# EAGLE design fb3.32_2x4_01 (EAGLE 5.00)
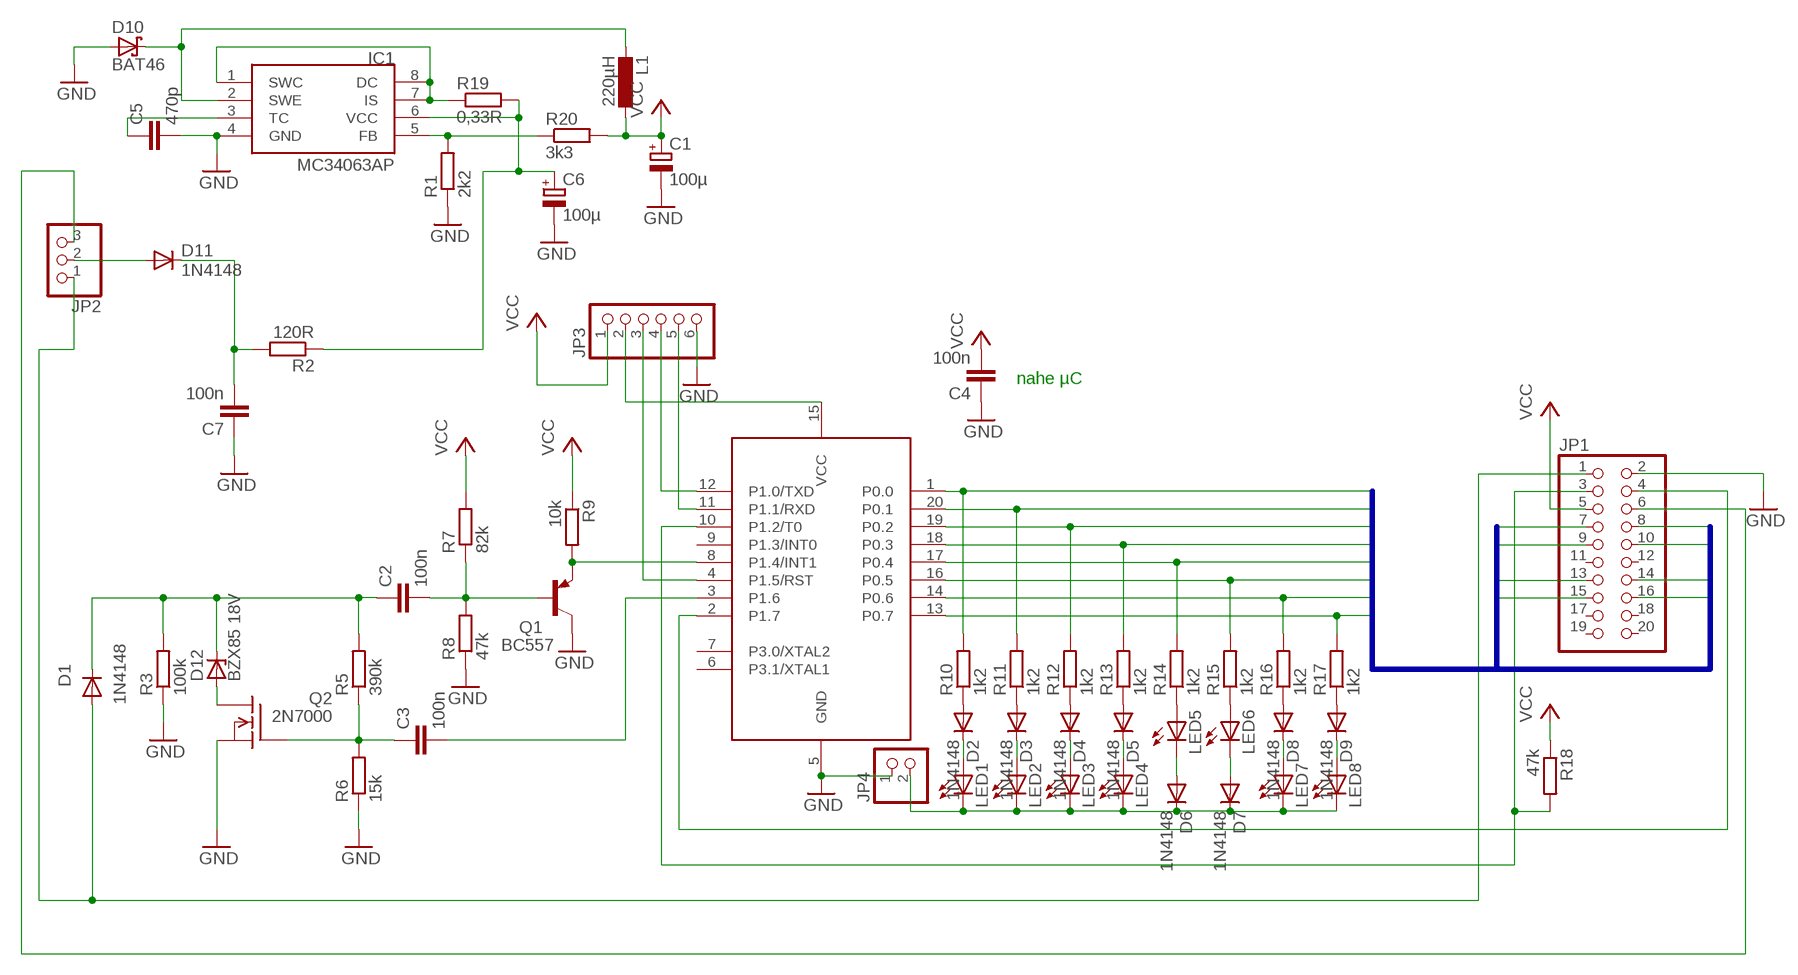
[diagram p0: schematic, sheet 1]

## Parts
C1  100µ  CPOL-EUE5-8.5  [E5-8,5]
C2  100n  C-EU050-024X044  [C050-024X044]
C3  100n  C-EU050-024X044  [C050-024X044]
C4  100n  C-EU050-024X044  [C050-024X044]
C5  470p  C-EU025-024X044  [C025-024X044]
C6  100µ  CPOL-EUE5-8.5  [E5-8,5]
C7  100n  C-EU050-024X044  [C050-024X044]
D1  1N4148  [DO35-10]
D2  1N4148  [DO35-10]
D3  1N4148  [DO35-10]
D4  1N4148  [DO35-10]
D5  1N4148  [DO35-10]
D6  1N4148  [DO35-10]
D7  1N4148  [DO35-10]
D8  1N4148  [DO35-10]
D9  1N4148  [DO35-10]
D10  BAT46  BAT49  [DO41-10]
D11  1N4148  [DO35-10]
D12  BZX85 18V  BZX85  [DO41Z10]
IC1  MC34063AP  [DIL08]
JP1  PINHD-2X10  [2X10]
JP2  PINHD-1X3  [1X03]
JP3  PINHD-1X6  [1X06]
JP4  PINHD-1X2  [1X02]
L1  220µH  L-EU2200-12.7  [2200-12.7]
LED1  LED3MM  [LED3MM]
LED2  LED3MM  [LED3MM]
LED3  LED3MM  [LED3MM]
LED4  LED3MM  [LED3MM]
LED5  LED3MM  [LED3MM]
LED6  LED3MM  [LED3MM]
LED7  LED3MM  [LED3MM]
LED8  LED3MM  [LED3MM]
Q1  BC557  [TO92]
Q2  2N7000  VN2222KM  [TO237]
R1  2k2  R-EU_0207/10  [0207/10]
R2  120R  R-EU_0207/10  [0207/10]
R3  100k  R-EU_0207/10  [0207/10]
R5  390k  R-EU_0207/10  [0207/10]
R6  15k  R-EU_0207/10  [0207/10]
R7  82k  R-EU_0207/10  [0207/10]
R8  47k  R-EU_0207/10  [0207/10]
R9  10k  R-EU_0207/2V  [0207/2V]
R10  1k2  R-EU_0207/10  [0207/10]
R11  1k2  R-EU_0207/10  [0207/10]
R12  1k2  R-EU_0207/10  [0207/10]
R13  1k2  R-EU_0207/10  [0207/10]
R14  1k2  R-EU_0207/10  [0207/10]
R15  1k2  R-EU_0207/5V  [0207/5V]
R16  1k2  R-EU_0207/10  [0207/10]
R17  1k2  R-EU_0207/10  [0207/10]
R18  47k  R-EU_0207/10  [0207/10]
R19  0,33R  R-EU_0207/10  [0207/10]
R20  3k3  R-EU_0207/10  [0207/10]
U1  89LPC922  [DIL20]

## Nets
BASIC_RECIVE: C2.2 Q1.2(B) R7.1 R8.2
EIB+: D1.A JP1.1 JP2.1
FET_GATE: C3.1 Q2.2(G) R5.1 R6.2
FREQ: C5.1 IC1.3(TC)
GND: C1.- C4.1 C5.2 C6.- C7.1 D10.A IC1.4(GND) JP1.2 JP3.6 JP4.1 Q1.3(C) Q2.3(S) R1.1 R3.1 R6.1 R8.1 U1.5(GND)
I_SENSED: IC1.1(SWC) IC1.7(IS) IC1.8(DC) R19.1
INDUCTOR: D10.C IC1.2(SWE) L1.2
LEDSELECT: D6.C D7.C JP4.2 LED1.K(C) LED2.K(C) LED3.K(C) LED4.K(C) LED7.K(C) LED8.K(C)
LPC_RECIVE: Q1.1(E) R9.2 U1.8(P1.4/INT1)
LPC_SEND: C3.2 U1.3(P1.6)
N$1: JP1.6 JP2.3
N$2: C7.2 D11.C R2.2
N$3: D2.A R10.1
N$4: D3.A R11.1
N$6: D12.A Q2.1(D)
N$7: IC1.5(FB) R1.2 R20.1
N$8: D4.A R12.1
N$10: D5.A R13.1
N$13: D8.A R16.1
N$14: D9.A R17.1
N$15: D2.C LED1.A
N$17: C2.1 D1.C D12.C R3.2 R5.2
N$20: D3.C LED2.A
N$21: D4.C LED3.A
N$22: D5.C LED4.A
N$23: D6.A LED5.K(C)
N$24: D7.A LED6.K(C)
N$25: D8.C LED7.A
N$26: D9.C LED8.A
N$27: LED5.A R14.1
N$29: JP3.4 U1.12(P1.0/TXD)
N$30: JP3.5 U1.11(P1.1/RXD)
N$31: JP3.3 U1.4(P1.5/RST)
N$35: LED6.A R15.1
P0.0: JP1.7 R10.2 U1.1(P0.0)
P0.1: JP1.8 R11.2 U1.20(P0.1)
P0.2: JP1.9 R12.2 U1.19(P0.2)
P0.3: JP1.10 R13.2 U1.18(P0.3)
P0.4: JP1.13 R14.2 U1.17(P0.4)
P0.5: JP1.14 R15.2 U1.16(P0.5)
P0.6: JP1.15 R16.2 U1.14(P0.6)
P0.7: JP1.16 R17.2 U1.13(P0.7)
PROG: JP1.4 U1.2(P1.7)
PWM_LPC: JP1.3 R18.2 U1.10(P1.2/T0)
SELECTED: D11.A JP2.2
SUPPLY_FILTRED: C6.+ IC1.6(VCC) R2.1 R19.2
VCC: C1.+ C4.2 JP1.5 JP3.1 L1.1 R7.2 R9.1 R18.1 R20.2
VCC_LPC: JP3.2 U1.15(VCC)
Unconnected: JP1.11 JP1.12 JP1.17 JP1.18 JP1.19 JP1.20 U1.6(P3.1/XTAL1) U1.7(P3.0/XTAL2) U1.9(P1.3/INT0)

## Buses
P0.[0..7]

## Notes on the sheet
- nahe µC

## Library data of the parts
C1 C6 = rcl:CPOL-EU: POLARIZED CAPACITOR, European symbol
C2-C5 C7 = rcl:C-EU: CAPACITOR, European symbol
D1-D9 D11 = diode:1N4148: DIODE high speed (Philips)
D10 = diode:BAT49: DIODE small signal diode
D12 = diode:BZX85: Z DIODE
IC1 = mc34063:MC34063
JP1 = pinhead:PINHD-2X10: PIN HEADER
JP2 = pinhead:PINHD-1X3: PIN HEADER
JP3 = pinhead:PINHD-1X6: PIN HEADER
JP4 = pinhead:PINHD-1X2: PIN HEADER
L1 = rcl:L-EU: INDUCTOR, European symbol
LED1-LED8 = led:LED: LED OSRAM: - CHIPLED LG R971, LG N971, LY N971, LG Q971, LY Q971, LO R971, LY R971 LH N974, LH R974 LS Q976, LO Q976, LY Q976 LO Q996 - Hyper CHIPLED LW Q18S LB Q993, LB Q99A, LB R99A - SideLED LS A670, LO A670, LY A670, LG A670, LP A670 LB A673, LV A673, LT A673, LW A673 LH A674 LY A675 LS A676, LA A676, LO A676, LY A676, LW A676 LS A679, LY A679, LG A679 - Hyper Micro SIDELED® LS Y876, LA Y876, LO Y876, LY Y876 LT Y87S - SmartLED LW L88C, LW L88S LB L89C, LB L89S, LG L890 LS L89K, LO L89K, LY L89K LS L896, LA L896, LO L896, LY L896 - TOPLED LS T670, LO T670, LY T670, LG T670, LP T670 LSG T670, LSP T670, LSY T670, LOP T670, LYG T670 LG T671, LOG T671, LSG T671 LB T673, LV T673, LT T673, LW T673 LH T674 LS T676, LA T676, LO T676, LY T676, LB T676, LH T676, LSB T676, LW T676 LB T67C, LV T67C, LT T67C, LS T67K, LO T67K, LY T67K, LW E67C LS E67B, LA E67B, LO E67B, LY E67B, LB E67C, LV E67C, LT E67C LW T67C LS T679, LY T679, LG T679 LS T770, LO T770, LY T770, LG T770, LP T770 LB T773, LV T773, LT T773, LW T773 LH T774 LS E675, LA E675, LY E675, LS T675 LS T776, LA T776, LO T776, LY T776, LB T776 LHGB T686 LT T68C, LB T68C - Hyper Mini TOPLED® LB M676 - Mini TOPLED Santana® LG M470 LS M47K, LO M47K, LY M47K Source: http://www.osram.convergy.de - LUMILED® LXK2-PW12-R00, LXK2-PW12-S00, LXK2-PW14-U00, LXK2-PW14-V00 LXK2-PM12-R00, LXK2-PM12-S00, LXK2-PM14-U00 LXK2-PE12-Q00, LXK2-PE12-R00, LXK2-PE12-S00, LXK2-PE14-T00, LXK2-PE14-U00 LXK2-PB12-K00, LXK2-PB12-L00, LXK2-PB12-M00, LXK2-PB14-N00, LXK2-PB14-P00, LXK2-PB14-Q00 LXK2-PR12-L00, LXK2-PR12-M00, LXK2-PR14-Q00, LXK2-PR14-R00 LXK2-PD12-Q00, LXK2-PD12-R00, LXK2-PD12-S00 LXK2-PH12-R00, LXK2-PH12-S00 LXK2-PL12-P00, LXK2-PL12-Q00, LXK2-PL12-R00 Source: www.luxeon.com
Q1 = transistor-pnp:BC557: PNP Transistor
Q2 = transistor-fet:VN2222KM: N-Channel Enhancement MOSFET (VMOS); 60V; 0,5A; 7,5Ohm
R1-R3 R5-R20 = rcl:R-EU_: RESISTOR, European symbol
U1 = micro-philips:89LPC922

## Board
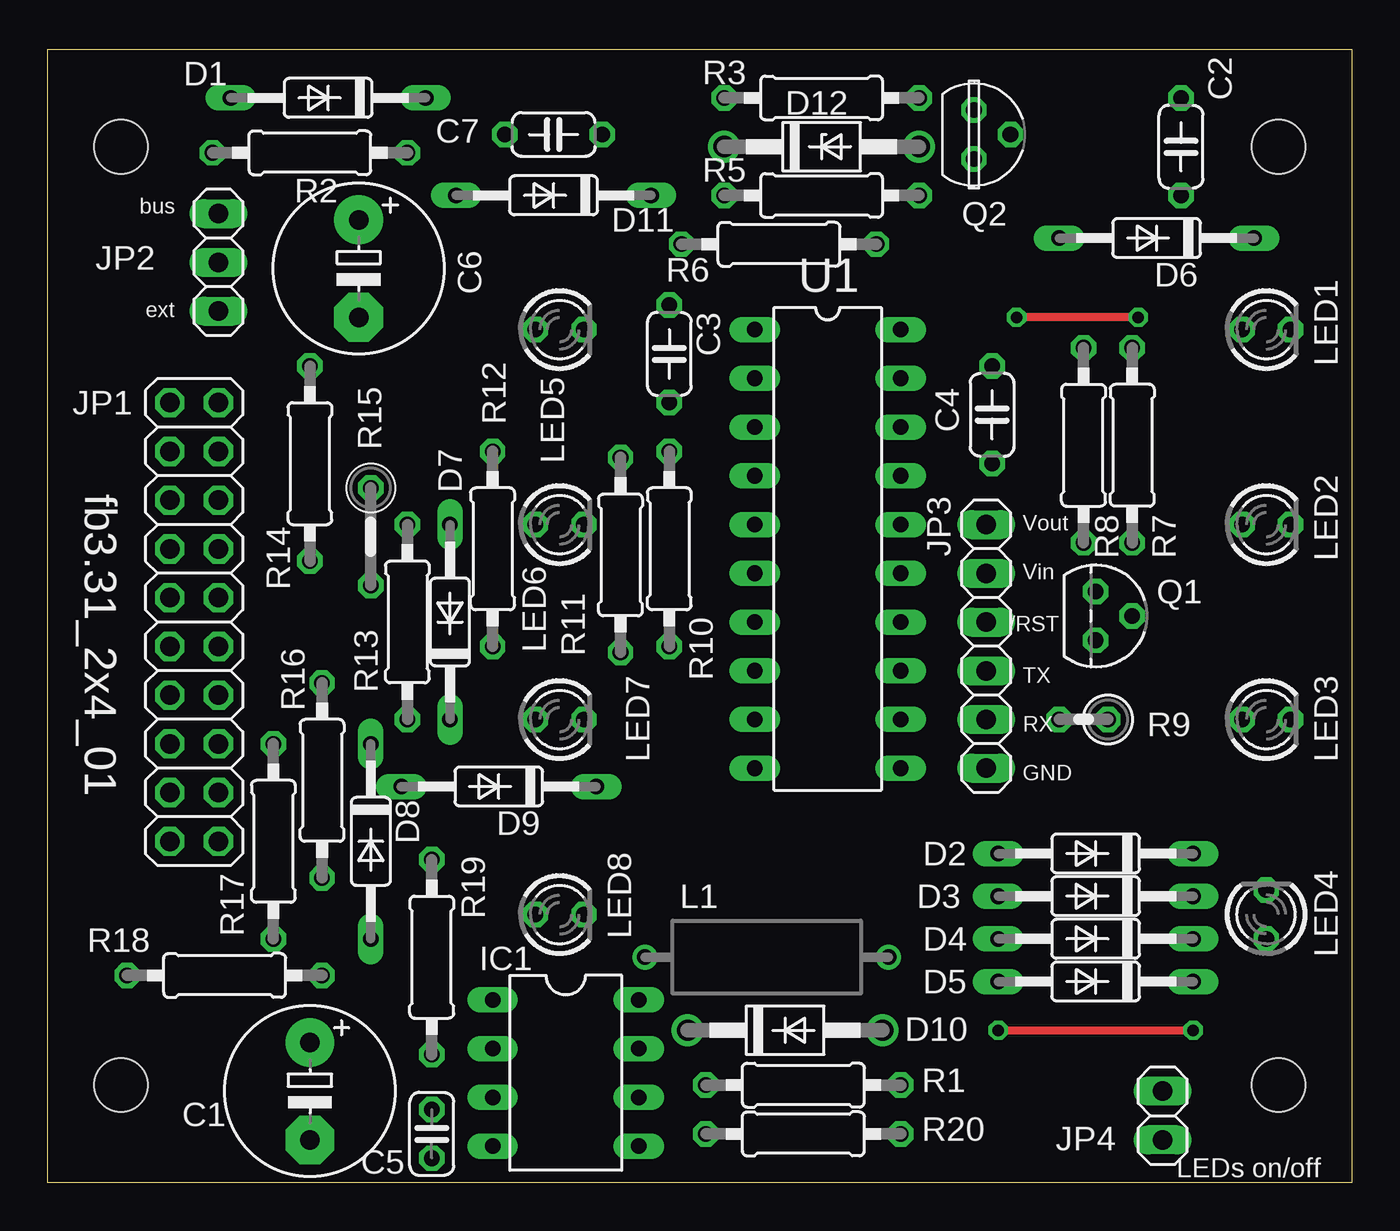
[diagram p1: board, top side]
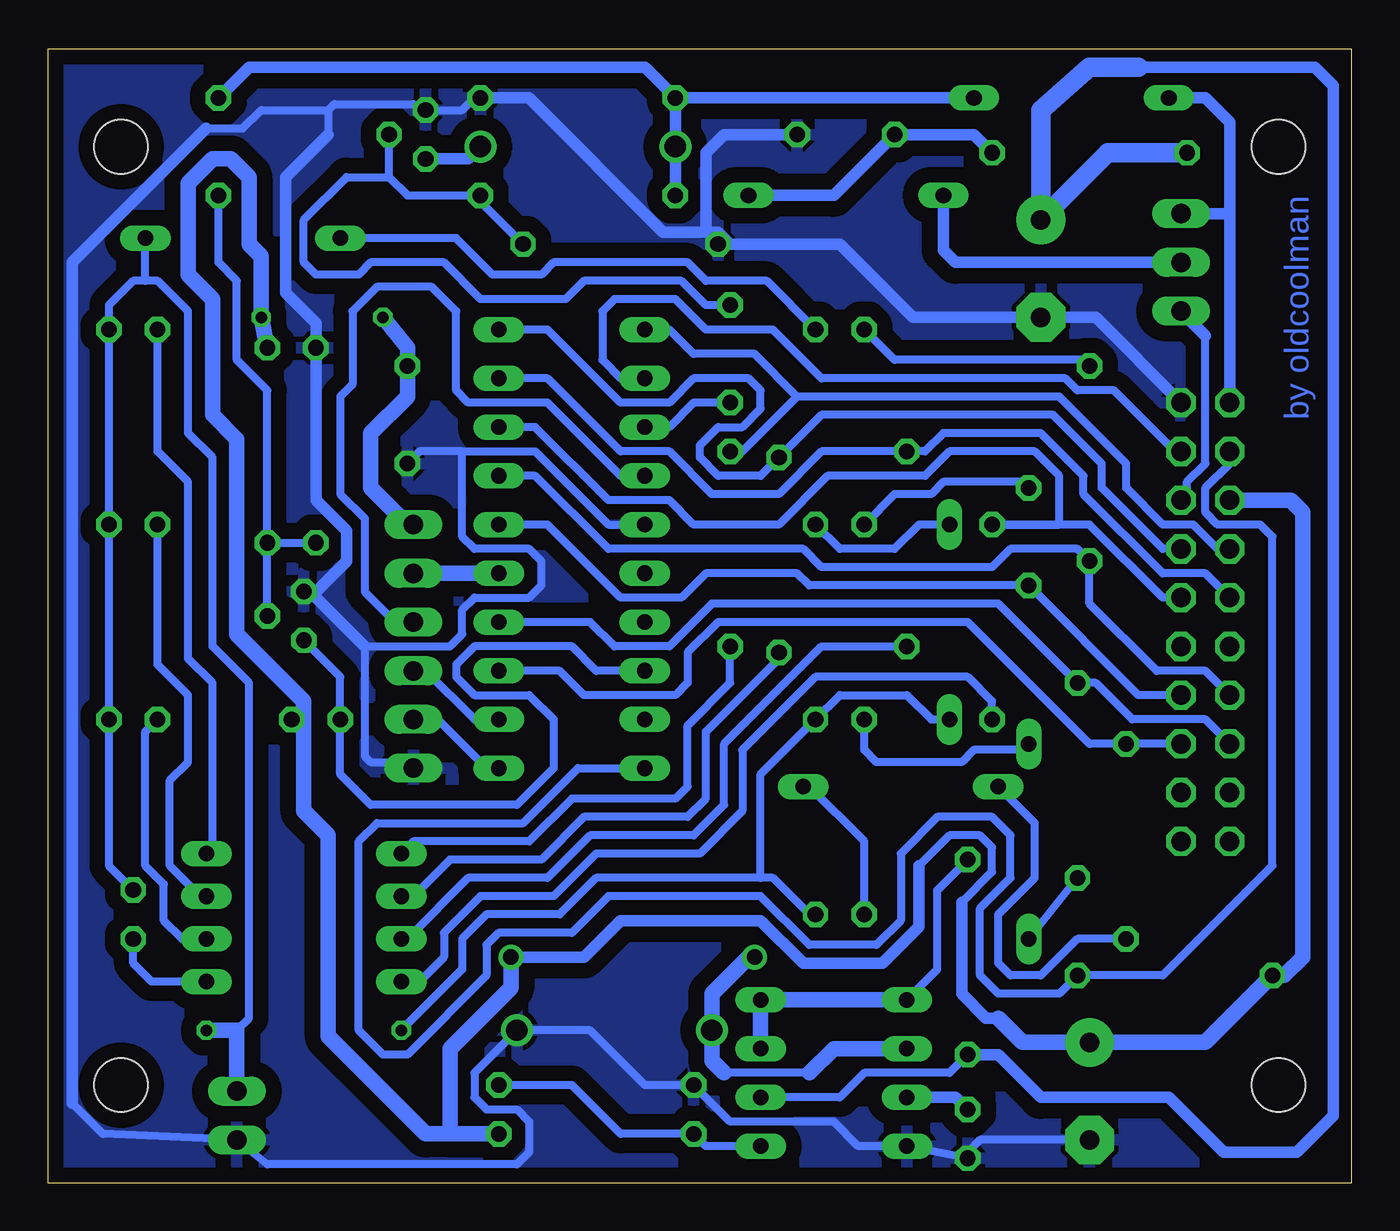
[diagram p2: board, bottom side, seen from below]

Size 67.94 x 59.05 mm. Coordinates in mm from the lower left corner, seen from the top.
Outline: 0,0 0,59.05 67.94,59.05 67.94,0 0,0
Copper layers (1*16): Top 0.035mm / dielectric 1.5mm / Bottom 0.035mm
Design rules "default": minimum track width 10mil, minimum drill 24mil, track to track 12mil, track to pad 12mil, pad to pad 12mil, via to via 12mil, smd to smd 8mil, copper to edge 20mil, drill to drill 8mil, minimum pad ring 10mil, minimum via ring 8mil, stop-mask expansion 4mil, vias tented up to drill 0mil, thermal gap 10mil
Holes 2.8 mm at 3.81,53.98 64.14,53.98 64.14,5.08 3.81,5.08

### Footprints (pad centres in the part's own frame; a part is rotated, then mirrored left to right if it is on the bottom)
E5-8,5 = drill 1.016 pad 2.54 round: + -2.54,0 | drill 1.016 pad 2.54 octagon: - 2.54,0
C050-024X044 = drill 0.813 octagon: 1 -2.54,0; 2 2.54,0
C025-024X044 = drill 0.813 octagon: 1 -1.27,0; 2 1.27,0
DO35-10 = drill 0.813 long: A 5.08,0; C -5.08,0
DO41-10 = drill 1.118 round: A 5.08,0; C -5.08,0
DO41Z10 = drill 1.118 round: A 5.08,0; C -5.08,0
DIL08 = drill 0.813 long: 1 -3.81,-3.81; 2 -1.27,-3.81; 3 1.27,-3.81; 4 3.81,-3.81; 5 3.81,3.81; 6 1.27,3.81; 7 -1.27,3.81; 8 -3.81,3.81
2X10 = drill 1.016 octagon: 1 -11.43,-1.27; 2 -11.43,1.27; 3 -8.89,-1.27; 4 -8.89,1.27; 5 -6.35,-1.27; 6 -6.35,1.27; 7 -3.81,-1.27; 8 -3.81,1.27; 9 -1.27,-1.27; 10 -1.27,1.27; 11 1.27,-1.27; 12 1.27,1.27; 13 3.81,-1.27; 14 3.81,1.27; 15 6.35,-1.27; 16 6.35,1.27; 17 8.89,-1.27; 18 8.89,1.27; 19 11.43,-1.27; 20 11.43,1.27
1X03 = drill 1.016 long: 1 -2.54,0; 2 0,0; 3 2.54,0
1X06 = drill 1.016 long: 1 -6.35,0; 2 -3.81,0; 3 -1.27,0; 4 1.27,0; 5 3.81,0; 6 6.35,0
1X02 = drill 1.016 long: 1 -1.27,0; 2 1.27,0
2200-12.7 = drill 0.8 pad 1.27 round: 1 -6.35,0; 2 6.35,0
LED3MM = drill 0.813 octagon: A -1.27,0; K 1.27,0
TO92 = drill 0.813 octagon: 1 1.27,0; 2 0,1.905; 3 -1.27,0
TO237 = drill 0.813 octagon: 1 1.27,0; 2 0,1.905; 3 -1.27,0
0207/10 = drill 0.813 octagon: 1 -5.08,0; 2 5.08,0
0207/2V = drill 0.813 octagon: 1 -1.27,0; 2 1.27,0
0207/5V = drill 0.813 octagon: 1 -2.54,0; 2 2.54,0
DIL20 = drill 0.813 long: 1 -11.43,-3.81; 2 -8.89,-3.81; 3 -6.35,-3.81; 4 -3.81,-3.81; 5 -1.27,-3.81; 6 1.27,-3.81; 7 3.81,-3.81; 8 6.35,-3.81; 9 8.89,-3.81; 10 11.43,-3.81; 11 11.43,3.81; 12 8.89,3.81; 13 6.35,3.81; 14 3.81,3.81; 15 1.27,3.81; 16 -1.27,3.81; 17 -3.81,3.81; 18 -6.35,3.81; 19 -8.89,3.81; 20 -11.43,3.81

### Placement (x,y rotation side)
C1  13.65,4.76 270 top
C2  59.05,53.98 270 top
C3  32.38,43.18 270 top
C4  49.21,40.01 90 top
C5  20,2.54 270 top
C6  16.19,47.62 270 top
C7  26.35,54.61 180 top
D1  14.61,56.52 180 top
D2  54.61,17.14 180 top
D3  54.61,14.92 180 top
D4  54.61,12.7 180 top
D5  54.61,10.48 180 top
D6  57.78,49.21 180 top
D7  20.95,29.21 90 top
D8  16.83,17.78 270 top
D9  23.5,20.64 180 top
D10  38.42,7.94 0 top
D11  26.35,51.44 180 top
D12  40.32,53.98 0 top
IC1  26.99,5.71 270 top
JP1  7.62,29.21 270 top
JP2  8.89,47.94 270 top
JP3  48.9,27.94 270 top
JP4  58.1,3.49 90 top
L1  37.47,11.75 180 top
LED1  63.5,44.45 0 top
LED2  63.5,34.29 0 top
LED3  63.5,24.13 0 top
LED4  63.5,13.97 90 top
LED5  26.67,44.45 0 top
LED6  26.67,34.29 0 top
LED7  26.67,24.13 0 top
LED8  26.67,13.97 0 top
Q1  54.61,29.53 270 top
Q2  48.26,54.61 270 top
R1  39.37,5.08 0 top
R2  13.65,53.66 0 top
R3  40.32,56.52 180 top
R5  40.32,51.44 180 top
R6  38.1,48.9 0 top
R7  56.52,38.42 90 top
R8  53.98,38.42 270 top
R9  53.98,24.13 180 top
R10  32.38,33.02 90 top
R11  29.84,32.7 90 top
R12  23.18,33.02 90 top
R13  18.73,29.21 90 top
R14  13.65,37.47 270 top
R15  16.83,33.66 270 top
R16  14.29,20.95 90 top
R17  11.75,17.78 90 top
R18  9.21,10.79 0 top
R19  20,11.75 270 top
R20  39.37,2.54 0 top
U1  40.64,33.02 270 top

### Tracks (layer width: path | path; a pad name or v marks a point on that pad's centre or on a via)
BASIC_RECIVE
  Bottom 0.406: R7.1 R8.2 R7.1 | Q1.2 R7.1 | R7.1 56.52,41.27 58.1,42.86 58.1,46.99 59.05,47.94 C2.2
EIB+
  Bottom 0.61: JP1.1 6.35,50.48 | 6.35,50.48 6.35,55.24 7.62,56.52 D1.A | 6.35,50.48 JP2.1
FET_GATE
  Bottom 0.406: 50.16,52.39 49.21,51.44 R5.1 45.4,51.12 R6.2 | 50.16,52.39 Q2.2 | C3.1 33.66,45.72 34.92,46.99 40.01,46.99 40.96,46.04 45.4,46.04 47.31,47.94 51.12,47.94 51.75,47.31 53.98,47.31 54.61,47.94 54.61,50.16 52.39,52.39 50.16,52.39
FREQ
  Bottom 0.61: C5.1 20.64,4.45 IC1.3
GND
  Bottom 0.406: R3.1 45.72,56.52 46.35,55.88 Q2.3 48.58,55.88 48.9,56.2 53.02,56.2 53.34,55.88 | U1.5 38.73,34.29 42.55,38.1 46.35,38.1 | 53.34,55.88 56.83,55.88 57.78,54.93 59.69,54.93 | 46.35,38.1 46.35,33.66 45.72,33.02 42.86,33.02 42.23,32.38 42.23,31.11 42.86,30.48 45.72,30.48 46.35,29.84 46.35,28.57 46.99,27.94 51.44,27.94 51.44,22.23 51.12,21.91 49.21,21.91 JP3.6 | C4.1 48.58,38.1 46.35,38.1 | 54.29,30.8 Q1.3 53.98,30.8 | 66.67,4.13 65.09,2.54 JP4.1 56.52,0.95 43.5,0.95 42.86,1.59 42.86,3.17 43.5,3.81 45.09,3.81 45.72,4.45 45.72,5.71 D10.A 39.69,7.94 36.83,5.08 R1.1 32.38,3.17 26.99,3.17 25.72,1.91 IC1.4 C5.2 20,1.59 19.37,2.22 C1.- | 53.34,55.88 53.34,54.61
  Bottom 0.61: 54.29,30.8 51.44,27.94 | 53.98,30.8 52.39,32.38 52.39,33.97 53.98,35.56 R8.1 53.98,44.77 55.56,46.35 55.56,52.39 53.34,54.61 | 66.67,4.13 66.67,47.94 59.69,54.93 | R3.1 42.86,56.52 35.88,49.53 33.66,49.53 | 33.66,49.53 33.02,49.53 | 33.02,49.53 R6.1 | JP1.2 13.34,45.09 C6.- 22.86,45.09 26.67,48.9 32.38,48.9 33.02,49.53 | C7.1 32.7,54.61 33.66,53.66 33.66,49.53
  pour Bottom (isolate 0.813): -0.95,60.01 69.53,60.01 69.53,-1.27 -0.95,-1.27 -0.95,58.1
I_SENSED
  Bottom 0.406: R19.1 21.59,15.24 21.59,11.11 IC1.1
  Bottom 0.813: IC1.7 IC1.8 IC1.1
INDUCTOR
  Bottom 0.406: 31.43,11.75 L1.2 | 28.26,5.71 32.7,5.71
  Bottom 0.813: 31.43,11.75 33.34,9.84 D10.C 33.34,6.35 32.7,5.71 | IC1.2 26.99,6.99 28.26,5.71
LEDSELECT  (via drill 0.6)
  Top 0.406: v49.53,7.94 v59.69,7.94
  Bottom 0.406: LED4.K 64.77,16.51 LED3.K LED2.K LED1.K 64.77,45.72 63.5,46.99 62.87,46.99 | D7.C 21.91,24.13 23.18,25.4 26.67,25.4 LED7.K 30.8,21.27 30.8,15.88 | 58.1,7.94 57.47,8.57 57.47,26.04 59.37,27.94 59.37,37.78 60.64,39.05 60.64,45.4 62.23,46.99 62.87,46.99 | 62.87,46.99 D6.C | LED8.K 28.26,13.97 30.16,15.88 30.8,15.88 | 30.8,15.88 39.37,15.88 41.27,13.97 45.09,13.97 46.35,12.7 46.35,11.11 v49.53,7.94
  Bottom 0.813: JP4.2 58.1,7.94 v59.69,7.94
LPC_RECIVE
  Bottom 0.406: U1.8 39.37,26.67 40.64,27.94 45.72,27.94 46.67,26.99 46.67,26.35 45.72,25.4 42.86,25.4 41.59,24.13 41.59,21.59 43.5,19.68 51.12,19.68 52.7,21.27 R9.2 52.7,26.35 Q1.1
LPC_SEND
  Bottom 0.406: C3.2 34.29,40.64 35.56,39.37 U1.3
N$1
  Bottom 0.406: JP1.6 8.89,35.88 8.57,36.2 8.57,36.51 7.62,37.47 7.62,44.13
  Bottom 0.61: 7.62,44.13 JP2.3
N$2
  Bottom 0.61: R2.2 19.68,54.61 C7.2 26.99,51.44 D11.C
N$3
  Bottom 0.406: D2.A 48.9,17.78 42.86,17.78 40.64,20 35.24,20 34.61,20.64 34.61,23.81 32.38,26.04 R10.1
N$4
  Bottom 0.406: R11.1 29.84,27.3 33.66,23.5 33.66,20 34.61,19.05 40.01,19.05 42.23,16.83 46.99,16.83 48.9,14.92 D3.A
N$5  (via drill 0.6)
  other vias: 3.81,53.98
N$6
  Bottom 0.61: D12.A 46.04,53.34 Q2.1
N$7
  Bottom 0.406: R1.2 40.64,5.08 38.1,2.54 R20.1 33.66,1.91 IC1.5
N$8
  Bottom 0.406: R12.1 27.62,27.94 32.7,22.86 32.7,19.68 34.29,18.1 39.69,18.1 41.91,15.88 46.04,15.88 49.21,12.7 D4.A
N$9  (via drill 0.6)
  other vias: 3.81,5.08
N$10
  Bottom 0.406: R13.1 18.73,25.08 20,26.35 27.94,26.35 31.75,22.54 31.75,19.37 33.97,17.14 39.37,17.14 41.59,14.92 45.4,14.92 47.31,13.02 47.31,11.75 48.58,10.48 D5.A
N$11  (via drill 0.6)
  other vias: 64.14,53.98
N$12  (via drill 0.6)
  other vias: 64.14,5.08
N$13
  Bottom 0.406: D8.A R16.1
N$14
  Bottom 0.406: R17.1 14.29,12.7 16.19,10.79 17.78,10.79 18.41,11.43 18.41,13.97 16.51,15.88 16.51,18.73 D9.A
N$15
  Bottom 0.406: LED1.A 62.23,38.1 60.64,36.51 60.64,27.3 59.37,26.04 59.37,17.46 D2.C
N$17
  Bottom 0.61: D1.C R3.2 | R3.2 D12.C R5.2 | R3.2 36.83,58.1 57.47,58.1 C2.1
N$20
  Bottom 0.406: LED2.A 62.23,26.99 60.64,25.4 60.64,21.91 61.59,20.95 61.59,16.51 60.01,14.92 D3.C
N$21
  Bottom 0.406: LED3.A 62.87,23.5 62.87,16.51 61.91,15.56 61.91,13.65 60.96,12.7 D4.C
N$22
  Bottom 0.406: D5.C 60.33,10.48 62.55,10.48 63.5,11.43 LED4.A
N$23
  Bottom 0.406: LED5.K 30.48,46.99 33.66,46.99 34.61,47.94 41.59,47.94 42.23,47.31 44.77,47.31 46.67,49.21 D6.A
N$24
  Bottom 0.406: D7.A 22.54,34.29 23.81,33.02 26.67,33.02 LED6.K
N$25
  Bottom 0.406: D8.C 17.14,22.54 19.68,22.54 20.32,21.91 24.77,21.91 25.4,22.54 LED7.A
N$26
  Bottom 0.406: LED8.A 25.4,17.78 28.26,20.64 D9.C
N$27
  Bottom 0.406: R14.1 13.97,42.86 23.81,42.86 LED5.A
N$29
  Bottom 0.406: U1.12 45.72,24.13 48.26,26.67 JP3.4
N$30
  Bottom 0.406: U1.11 45.09,21.59 47.62,24.13 JP3.5
N$31
  Bottom 0.406: U1.4 38.1,36.83 41.91,40.64 46.04,40.64 46.67,41.27 46.67,45.4 47.94,46.67 50.8,46.67 52.07,45.4 52.07,41.59 52.7,40.96 52.7,35.88 51.44,34.61 51.44,30.8 49.85,29.21 JP3.3
N$35
  Bottom 0.406: R15.1 17.14,36.51 21.27,36.51 21.91,35.88 23.81,35.88 LED6.A
P0.0
  Bottom 0.406: JP1.7 6.99,33.02 8.26,34.29 9.84,34.29 11.75,36.2 11.75,37.47 15.24,40.96 28.89,40.96 | U1.1 35.56,44.45 34.29,43.18 31.11,43.18 28.89,40.96 | R10.2 31.75,38.1 28.89,40.96
P0.1
  Bottom 0.406: JP1.8 9.84,33.02 13.02,36.2 13.02,37.47 15.56,40.01 27.62,40.01 R11.2 30.8,36.83 33.02,36.83 33.97,37.78 33.97,38.42 33.02,39.37 31.75,39.37 30.8,40.32 30.8,41.27 31.43,41.91 34.29,41.91 35.56,40.64 38.1,40.64 41.91,44.45 U1.20
P0.2
  Bottom 0.406: JP1.9 7.62,31.75 9.84,31.75 13.97,35.88 13.97,36.83 16.19,39.05 21.27,39.05 22.23,38.1 R12.2 27.62,38.1 29.84,35.88 33.34,35.88 35.56,38.1 38.1,38.1 41.91,41.91 U1.19
P0.3
  Bottom 0.406: JP1.10 9.84,30.48 13.65,34.29 R13.2 15.24,34.29 15.24,36.83 16.51,38.1 20.95,38.1 22.23,36.83 27.3,36.83 29.84,34.29 34.29,34.29 35.56,35.56 38.73,35.56 42.55,39.37 U1.18
P0.4
  Bottom 0.406: JP1.13 7.62,26.67 10.16,26.67 13.65,30.16 R14.2 14.29,33.02 17.78,33.02 18.73,32.07 27.62,32.07 28.57,33.02 38.73,33.02 42.55,36.83 U1.17
P0.5
  Bottom 0.406: JP1.14 11.11,25.4 R15.2 28.26,31.11 28.89,31.75 33.66,31.75 34.92,30.48 38.1,30.48 41.91,34.29 U1.16
P0.6
  Bottom 0.406: JP1.15 7.62,24.13 11.43,24.13 13.34,26.04 R16.2 18.41,30.16 33.34,30.16 35.56,27.94 38.42,27.94 39.69,29.21 U1.14
P0.7
  Bottom 0.406: JP1.16 R17.2 13.65,22.86 20,29.21 33.02,29.21 34.61,27.62 34.61,26.04 35.24,25.4 40.01,25.4 41.27,26.67 U1.13
PROG
  Bottom 0.406: JP1.4 9.21,38.1 12.38,41.27 14.29,41.27 14.92,41.91 27.62,41.91 30.16,44.45 33.66,44.45 35.24,46.04 38.42,46.04 39.05,45.4 39.05,42.86 38.1,41.91 U1.2
PWM_LPC
  Bottom 0.406: JP1.3 6.35,37.47 7.62,36.2 7.62,34.92 6.99,34.29 4.76,34.29 4.13,33.66 4.13,16.51 9.84,10.79 R18.2 15.24,9.84 18.41,9.84 19.37,10.79 19.37,14.29 17.78,15.88 17.78,18.1 18.73,19.05 21.59,19.05 23.5,17.14 23.5,13.65 24.77,12.38 28.26,12.38 30.8,14.92 38.73,14.92 40.64,13.02 44.45,13.02 45.09,12.38 45.09,10.79 49.21,6.67 50.48,6.67 51.75,7.94 51.75,17.78 50.8,18.73 43.18,18.73 40.32,21.59 U1.10
SELECTED
  Bottom 0.61: JP2.2 20.64,47.94 21.27,48.58 D11.A
SUPPLY_FILTRED
  Bottom 0.406: IC1.6 26.67,4.45 25.4,5.71 20.95,5.71 R19.2
  Bottom 0.61: 11.11,58.1 1.91,58.1 0.95,57.15 0.95,3.49 2.86,1.59 6.67,1.59 9.53,4.45 16.19,4.45 18.41,6.67 R19.2
  Bottom 1.016: 11.11,58.1 13.65,58.1 16.19,55.88 C6.+ 12.7,53.66 R2.1
VCC  (via drill 0.6)
  Top 0.406: v56.83,45.09 v50.48,45.09
  Bottom 0.406: 49.21,34.29 JP3.1 | R9.1 54.61,24.13 54.61,25.08 | R18.1 3.49,10.79 | 20.32,14.61 18.73,16.19 18.73,17.46 19.37,18.1 20.95,18.1 22.54,16.51
  Bottom 0.61: 18.41,8.57 19.05,8.57 20.32,9.84 20.32,14.61 | 22.54,16.51 22.54,13.34 24.45,11.43 28.57,11.43 30.8,13.65 38.1,13.65 40.01,11.75 L1.1
  Bottom 0.813: JP1.5 3.17,35.56 2.54,34.92 2.54,11.75 3.49,10.79 | 49.21,34.29 51.12,36.2 51.12,39.05 49.21,40.96 C4.2 49.21,43.5 v50.48,45.09 | R7.2 v56.83,45.09 56.83,48.26 57.47,48.9 57.47,52.39 58.42,53.34 59.37,53.34 60.64,52.07 60.64,47.31 59.37,46.04 59.37,40.01 58.1,38.73 58.1,28.57 54.61,25.08 54.61,19.37 53.34,18.1 53.34,7.62 48.26,2.54 46.99,2.54 | 46.99,2.54 R20.2 | 46.99,2.54 46.99,6.99 43.81,10.16 L1.1 | R18.1 7.62,7.3 C1.+ 17.14,7.3 18.41,8.57
VCC_LPC
  Bottom 0.813: U1.15 JP3.2

### Text on the board
Bottom: by oldcoolman
tPlace: bus | ext | fb3.31_2x4_01 | Vout | Vin | /RST | TX | RX | GND | LEDs on/off